# EAGLE design Maiskolben_THT (EAGLE 7.3.0)
CNAME: Maiskolben THT; CREVISION: 1.1; DESIGNER: Luca Zimmermann
Assembly variants: Mini USB, Mico USB

## Sheet 1 of 2
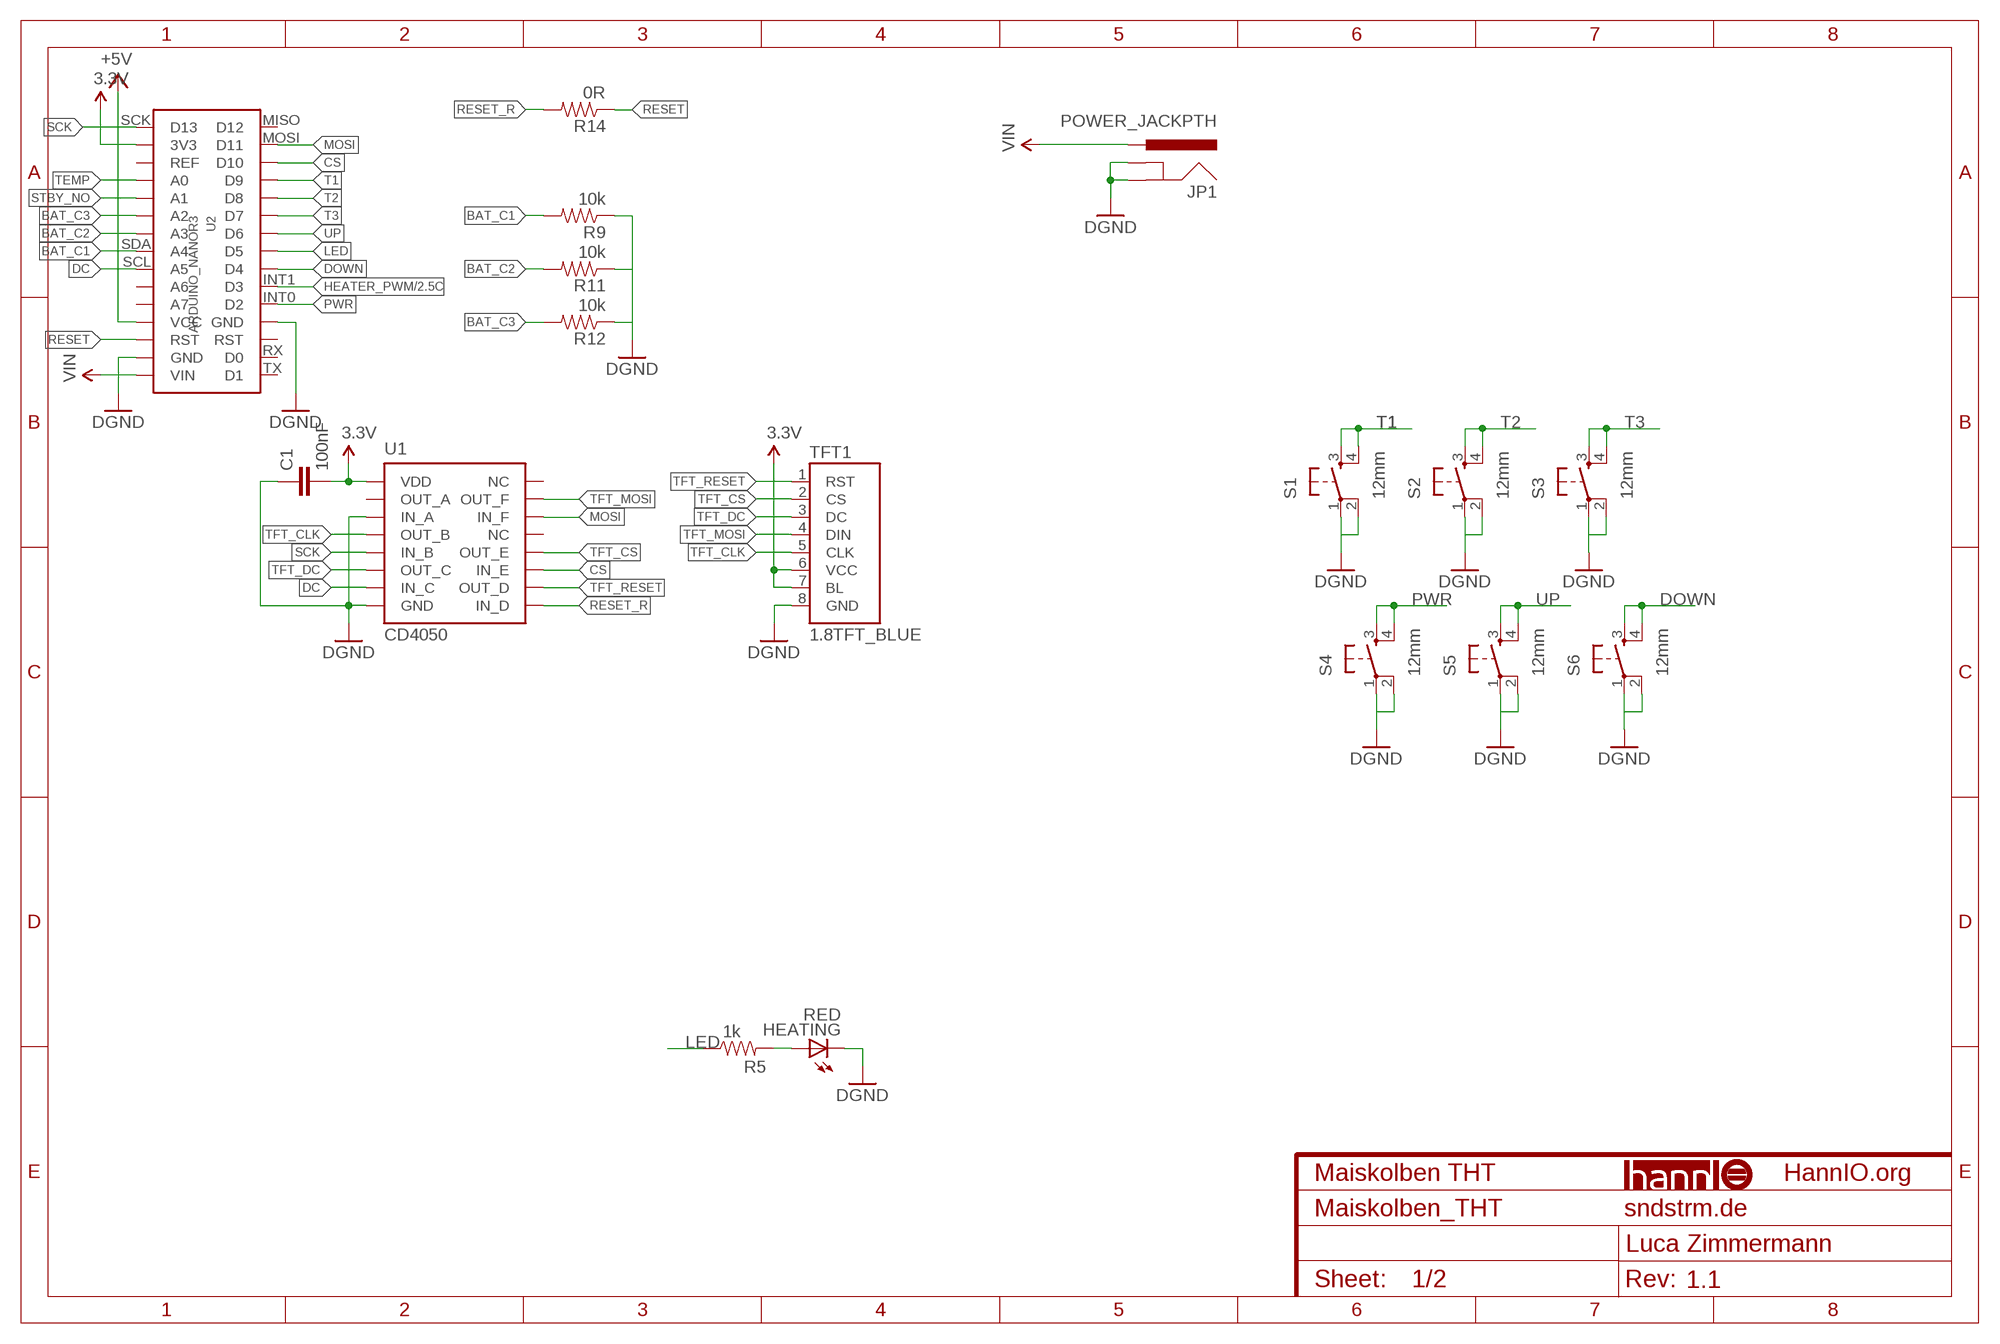
[diagram p0: schematic, sheet 1]

### Parts
C1  100nF  CAPEZ  [CAP-PTH-SMALLEZ]
HEATING  RED  LED5MM  [LED5MM]
JP1  POWER_JACKPTH  [POWER_JACK_PTH]
R5  1k  RESISTORAXIAL-0.3  [AXIAL-0.3]
R9  10k  RESISTORAXIAL-0.3  [AXIAL-0.3]
R11  10k  RESISTORAXIAL-0.3  [AXIAL-0.3]
R12  10k  RESISTORAXIAL-0.3  [AXIAL-0.3]
R14  0R  RESISTORAXIAL-0.3  [AXIAL-0.3]
S1  12mm  TAC_SWITCHPTH  [TACTILE-PTH]
S2  12mm  TAC_SWITCHPTH  [TACTILE-PTH]
S3  12mm  TAC_SWITCHPTH  [TACTILE-PTH]
S4  12mm  TAC_SWITCHPTH  [TACTILE-PTH]
S5  12mm  TAC_SWITCHPTH  [TACTILE-PTH]
S6  12mm  TAC_SWITCHPTH  [TACTILE-PTH]
TFT1  1.8TFT_BLUE  [1.8TFT_BLUE]
U1  CD4050DIP16  [CD4050]
U2  ARDUINO_NANOR3  [ARDUINO-NANO]
U$1  HANNIO_MEDIUM  [HANNIO_MEDIUM]

### Nets
3.3V: C1.2 TFT1.6(VCC) TFT1.7(BL) U1.VDD U2.3V3
+5V: U2.VCC ; also sheet 2
BAT_C1: R9.P$2 U2.SDA(A4)
BAT_C2: R11.P$2 U2.A3
BAT_C3: R12.P$2 U2.A2
CS: U1.IN_E U2.D10
DC: U1.IN_C U2.SCL(A5)
DGND: C1.1 HEATING.K(C) JP1.GND JP1.GNDBREAK R9.P$1 R11.P$1 R12.P$1 S1.1 S1.2 S2.1 S2.2 S3.1 S3.2 S4.1 S4.2 S5.1 S5.2 S6.1 S6.2 TFT1.8(GND) U1.GND U1.IN_A U2.GND@1(GND) U2.GND@2(GND) ; also sheet 2
DOWN: S6.3 S6.4 U2.D4
HEAT_LED: HEATING.A R5.P$2
HEATER_PWM: U2.INT1(D3) ; also sheet 2
LED: R5.P$1 U2.D5
MOSI: U1.IN_F U2.MOSI(D11)
PWR: S4.3 S4.4 U2.INT0(D2)
RESET: R14.P$1 U2.RST@2(RST)
RESET_R: R14.P$2 U1.IN_D
SCK: U1.IN_B U2.SCK(D13)
STBY_NO: U2.A1
T1: S1.3 S1.4 U2.D9
T2: S2.3 S2.4 U2.D8
T3: S3.3 S3.4 U2.D7
TEMP: U2.A0 ; also sheet 2
TFT_CLK: TFT1.5(CLK) U1.OUT_B
TFT_CS: TFT1.2(CS) U1.OUT_E
TFT_DC: TFT1.3(DC) U1.OUT_C
TFT_MOSI: TFT1.4(DIN) U1.OUT_F
TFT_RESET: TFT1.1(RST) U1.OUT_D
UP: S5.3 S5.4 U2.D6
VIN: JP1.PWR U2.VIN ; also sheet 2
Unconnected: U1.NC@1(NC) U1.NC@2(NC) U1.OUT_A U2.A6 U2.A7 U2.MISO(D12) U2.REF U2.RST@1(RST) U2.RX(D0) U2.TX(D1)

### Notes on the sheet
- HannIO.org
- sndstrm.de

## Sheet 2 of 2
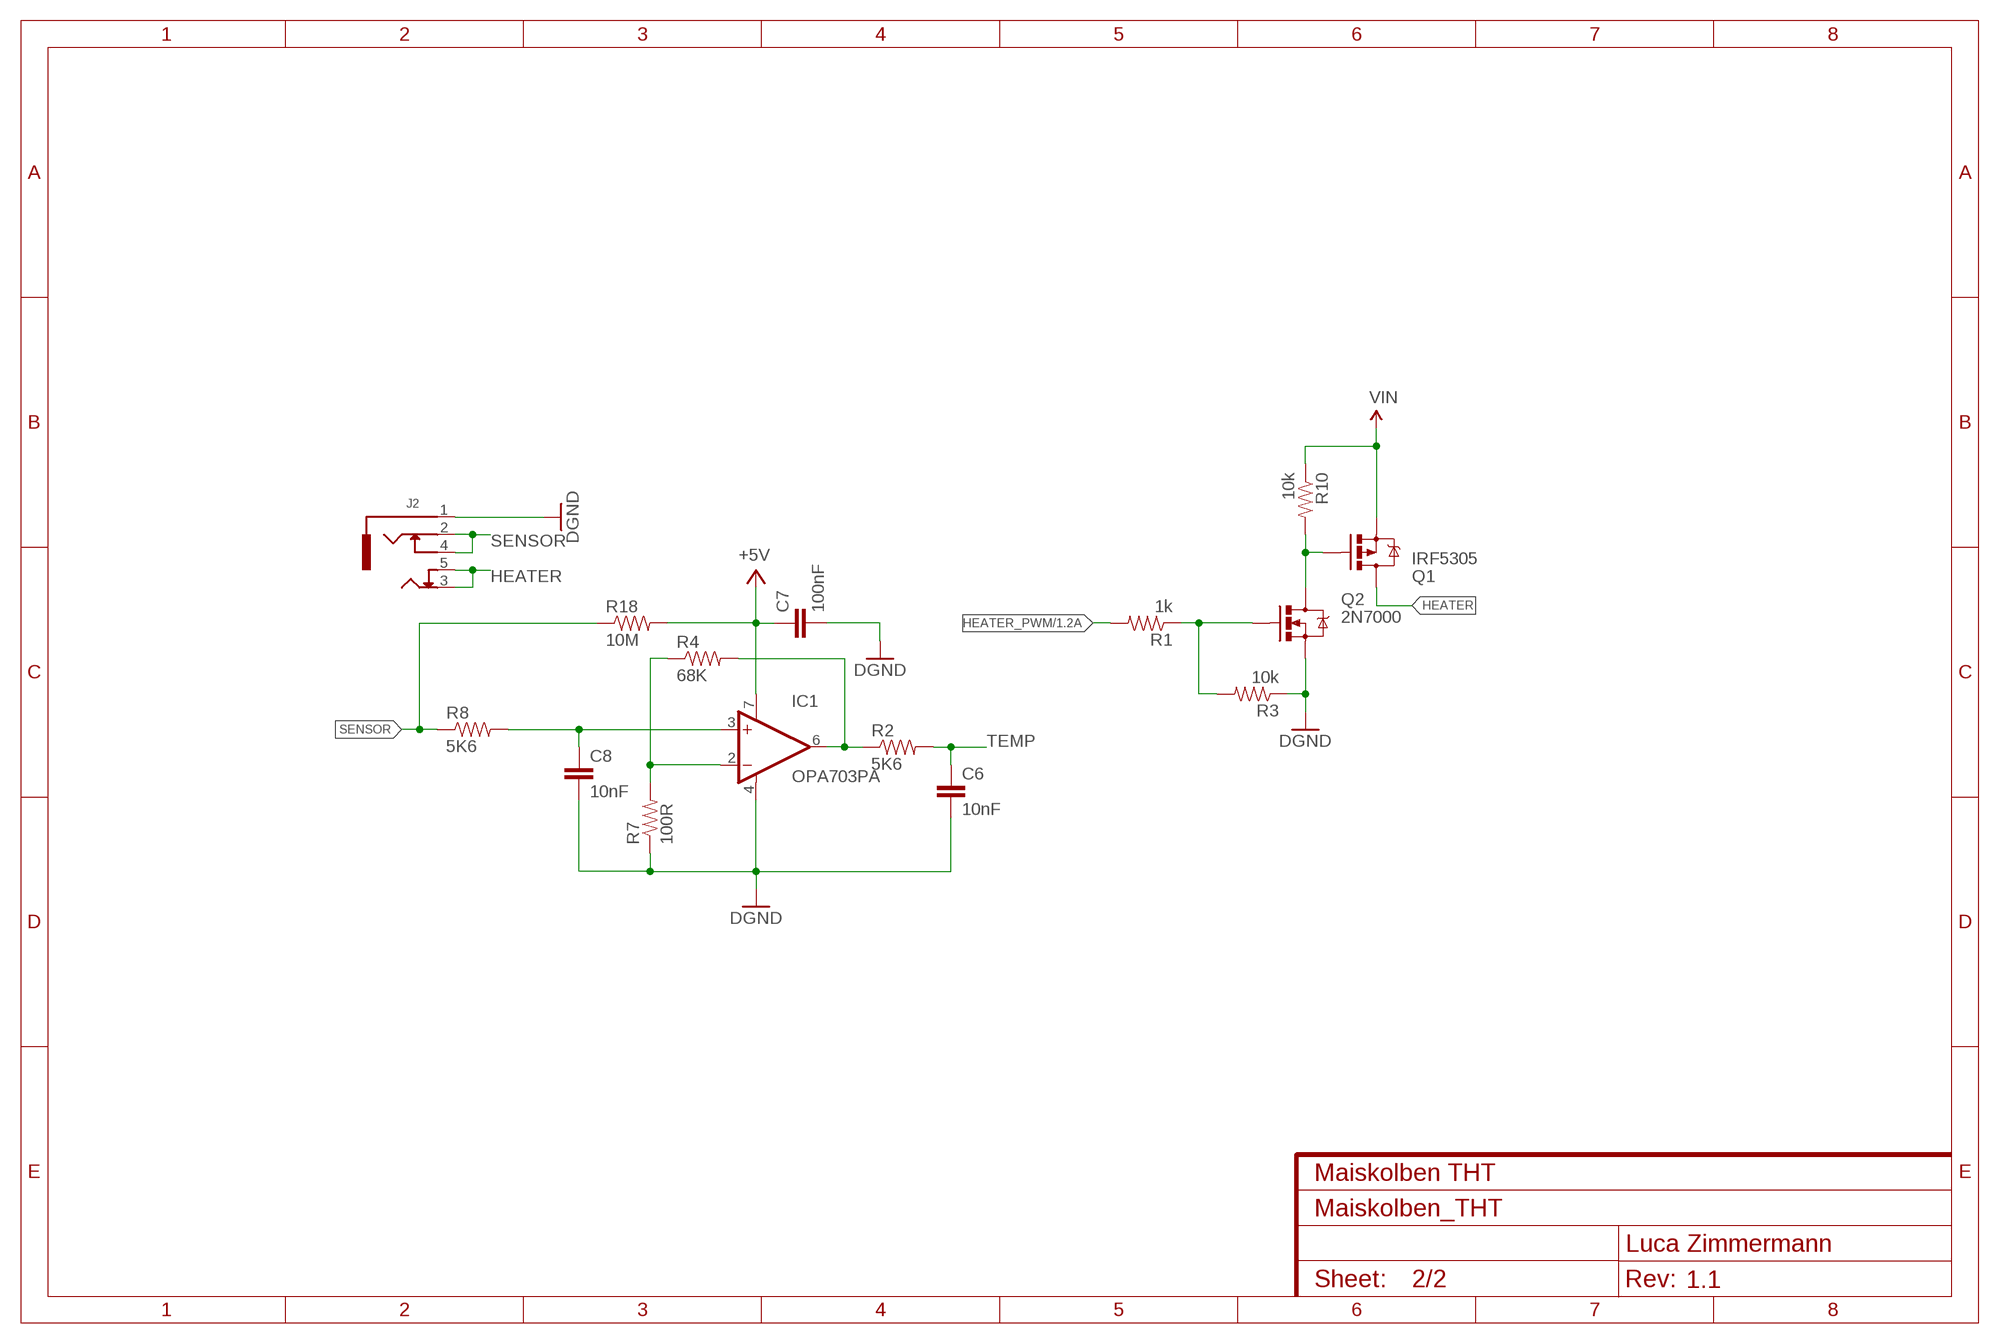
[diagram p1: schematic, sheet 2]

### Parts
C6  10nF  CAPEZ  [CAP-PTH-SMALLEZ]
C7  100nF  CAPEZ  [CAP-PTH-SMALLEZ]
C8  10nF  CAPEZ  [CAP-PTH-SMALLEZ]
IC1  OPA703PA  OPA340P  [DIL08]
J2  AUDIO_JACK_5PEBS_35  [EBS_35]
Q1  IRF5305  MOSFET-PCHANNELFQP27P06  [TO220V]
Q2  2N7000  MOSFET-NCHANNEL2N7000  [TO-92]
R1  1k  RESISTORAXIAL-0.3  [AXIAL-0.3]
R2  5K6  RESISTORAXIAL-0.3  [AXIAL-0.3]
R3  10k  RESISTORAXIAL-0.3  [AXIAL-0.3]
R4  68K  RESISTORAXIAL-0.3  [AXIAL-0.3]
R7  100R  RESISTORAXIAL-0.3  [AXIAL-0.3]
R8  5K6  RESISTORAXIAL-0.3  [AXIAL-0.3]
R10  10k  RESISTORAXIAL-0.3  [AXIAL-0.3]
R18  10M  RESISTORAXIAL-0.3  [AXIAL-0.3]

### Nets
+5V: C7.1 IC1.7(V+) R18.P$2 ; also sheet 1
DGND: C6.2 C7.2 C8.2 IC1.4(V-) J2.1(GND) Q2.1(S) R3.P$1 R7.P$1 ; also sheet 1
HEATER: J2.3(TIP) J2.5(TIP_NC) Q1.2(D)
HEATER_PWM: R1.P$2 ; also sheet 1
N$3: Q2.2(G) R1.P$1 R3.P$2
OPA+: C8.1 IC1.3(+IN) R8.P$2
OPA-: IC1.2(-IN) R4.P$1 R7.P$2
OPA_OUT: IC1.6(OUT) R2.P$1 R4.P$2
PMOS_IN: Q1.1(G) Q2.3(D) R10.P$2
SENSOR: J2.2(RING) J2.4(RING_NC) R8.P$1 R18.P$1
TEMP: C6.1 R2.P$2 ; also sheet 1
VIN: Q1.3(S) R10.P$1 ; also sheet 1

## Library data of the parts
C1 C6-C8 = SparkFun-Capacitors:CAP: Capacitor Standard 0603 ceramic capacitor, and 0.1" leaded capacitor.
HEATING = led:LED: LED OSRAM: - CHIPLED LG R971, LG N971, LY N971, LG Q971, LY Q971, LO R971, LY R971 LH N974, LH R974 LS Q976, LO Q976, LY Q976 LO Q996 - Hyper CHIPLED LW Q18S LB Q993, LB Q99A, LB R99A - SideLED LS A670, LO A670, LY A670, LG A670, LP A670 LB A673, LV A673, LT A673, LW A673 LH A674 LY A675 LS A676, LA A676, LO A676, LY A676, LW A676 LS A679, LY A679, LG A679 - Hyper Micro SIDELED® LS Y876, LA Y876, LO Y876, LY Y876 LT Y87S - SmartLED LW L88C, LW L88S LB L89C, LB L89S, LG L890 LS L89K, LO L89K, LY L89K LS L896, LA L896, LO L896, LY L896 - TOPLED LS T670, LO T670, LY T670, LG T670, LP T670 LSG T670, LSP T670, LSY T670, LOP T670, LYG T670 LG T671, LOG T671, LSG T671 LB T673, LV T673, LT T673, LW T673 LH T674 LS T676, LA T676, LO T676, LY T676, LB T676, LH T676, LSB T676, LW T676 LB T67C, LV T67C, LT T67C, LS T67K, LO T67K, LY T67K, LW E67C LS E67B, LA E67B, LO E67B, LY E67B, LB E67C, LV E67C, LT E67C LW T67C LS T679, LY T679, LG T679 LS T770, LO T770, LY T770, LG T770, LP T770 LB T773, LV T773, LT T773, LW T773 LH T774 LS E675, LA E675, LY E675, LS T675 LS T776, LA T776, LO T776, LY T776, LB T776 LHGB T686 LT T68C, LB T68C - Hyper Mini TOPLED® LB M676 - Mini TOPLED Santana® LG M470 LS M47K, LO M47K, LY M47K Source: http://www.osram.convergy.de LUXEON: - LUMILED® LXK2-PW12-R00, LXK2-PW12-S00, LXK2-PW14-U00, LXK2-PW14-V00 LXK2-PM12-R00, LXK2-PM12-S00, LXK2-PM14-U00 LXK2-PE12-Q00, LXK2-PE12-R00, LXK2-PE12-S00, LXK2-PE14-T00, LXK2-PE14-U00 LXK2-PB12-K00, LXK2-PB12-L00, LXK2-PB12-M00, LXK2-PB14-N00, LXK2-PB14-P00, LXK2-PB14-Q00 LXK2-PR12-L00, LXK2-PR12-M00, LXK2-PR14-Q00, LXK2-PR14-R00 LXK2-PD12-Q00, LXK2-PD12-R00, LXK2-PD12-S00 LXK2-PH12-R00, LXK2-PH12-S00 LXK2-PL12-P00, LXK2-PL12-Q00, LXK2-PL12-R00 Source: www.luxeon.com KINGBRIGHT: KA-3528ASYC Source: www.kingbright.com
IC1 = burr-brown:OPA340: Rail-to-Rail Operational Amplifiers Single-Supply, MicroAmplifier(TM) Series; MPN: OPA340PA; OC_FARNELL: 1097413; OC_NEWARK: 97K6826
J2 = rgb_matrix:AUDIO_JACK_5P
JP1 = SparkFun-Connectors:POWER_JACK: Power Jack This is the standard 5.5mm barrel jack for power. The PTH is the most common, proven, reliable, footprint. The Slot footprint only works if the mill layer is transmitted to the PCB fab house so be warned. Mating wall wart : TOL-00298 (and others); PROD_ID: CONN-08197
Q1 = SparkFun-DiscreteSemi:MOSFET-PCHANNEL: Generic PMOSFET IRLML2244 - TRANS-11153 (SOT-23 -20V -4.3A) (1.Gate 2.Source 3.Drain) FQP27P06 - COM-10349 <http://www.sparkfun.com/products/10349> (TO-220 -60V -27A) (1.Gate 2.Source 3.Drain)
Q2 = SparkFun-DiscreteSemi:MOSFET-NCHANNEL: Common NMOSFET Parts MFG P/N Store ID Prod ID FDD8780 TRANS-09984 SI7820DN TRANS-11055 FDS6630A IC-08089 2N7002PW TRANS-11151 FQP30N06L COM-10213 TRANS-10060 BSS123LT1G TRANS-08345 BSS138 TRANS-00830 BS170 2N7000
R1-R5 R7-R12 R14 R18 = SparkFun-Resistors:RESISTOR: Resistor Basic schematic elements and footprints for 0603, 1206, and PTH resistors.
S1-S6 = SparkFun-Retired:TAC_SWITCH: Momentary Switch Button commonly used for reset or general input. Spark Fun Electronics SKU : COM-00097 SMT- SWCH-08247
TFT1 = rgb_matrix:1.8TFT_BLUE
U1 = Aldar:CD4050
U2 = Aldar:ARDUINO_NANO: Arduino NANO R3
U$1 = rgb_matrix:HANNIO

## Board
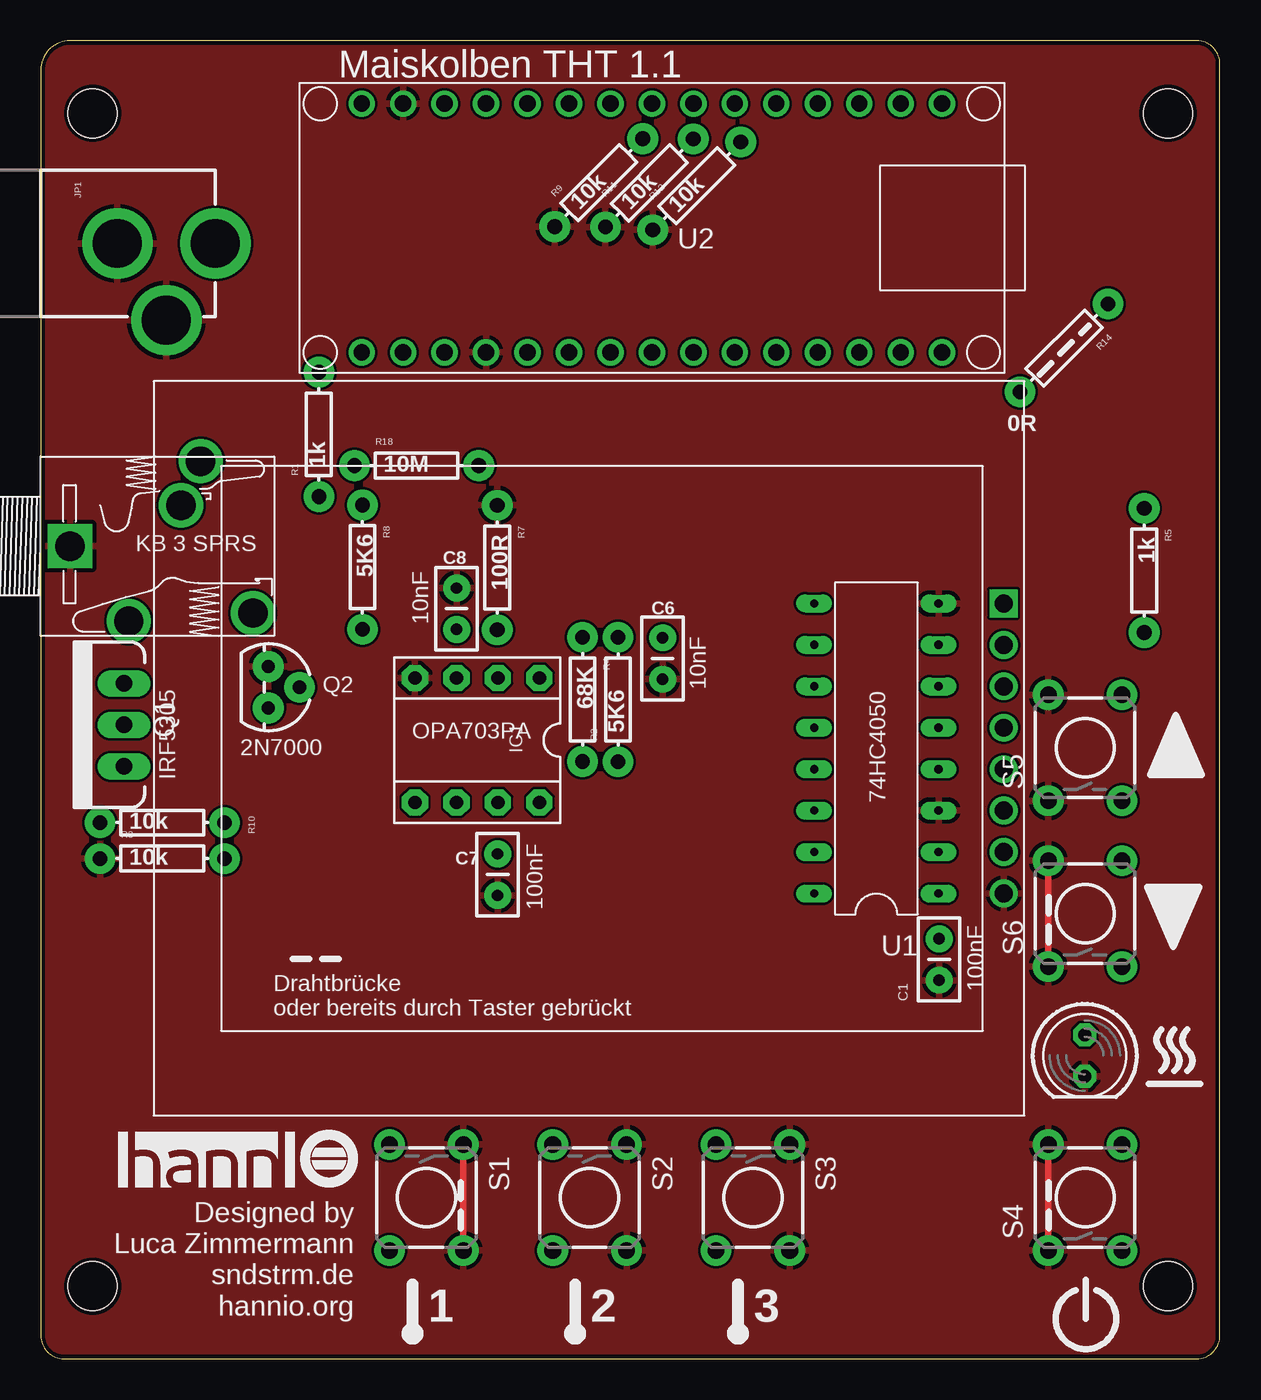
[diagram p2: board, top side]
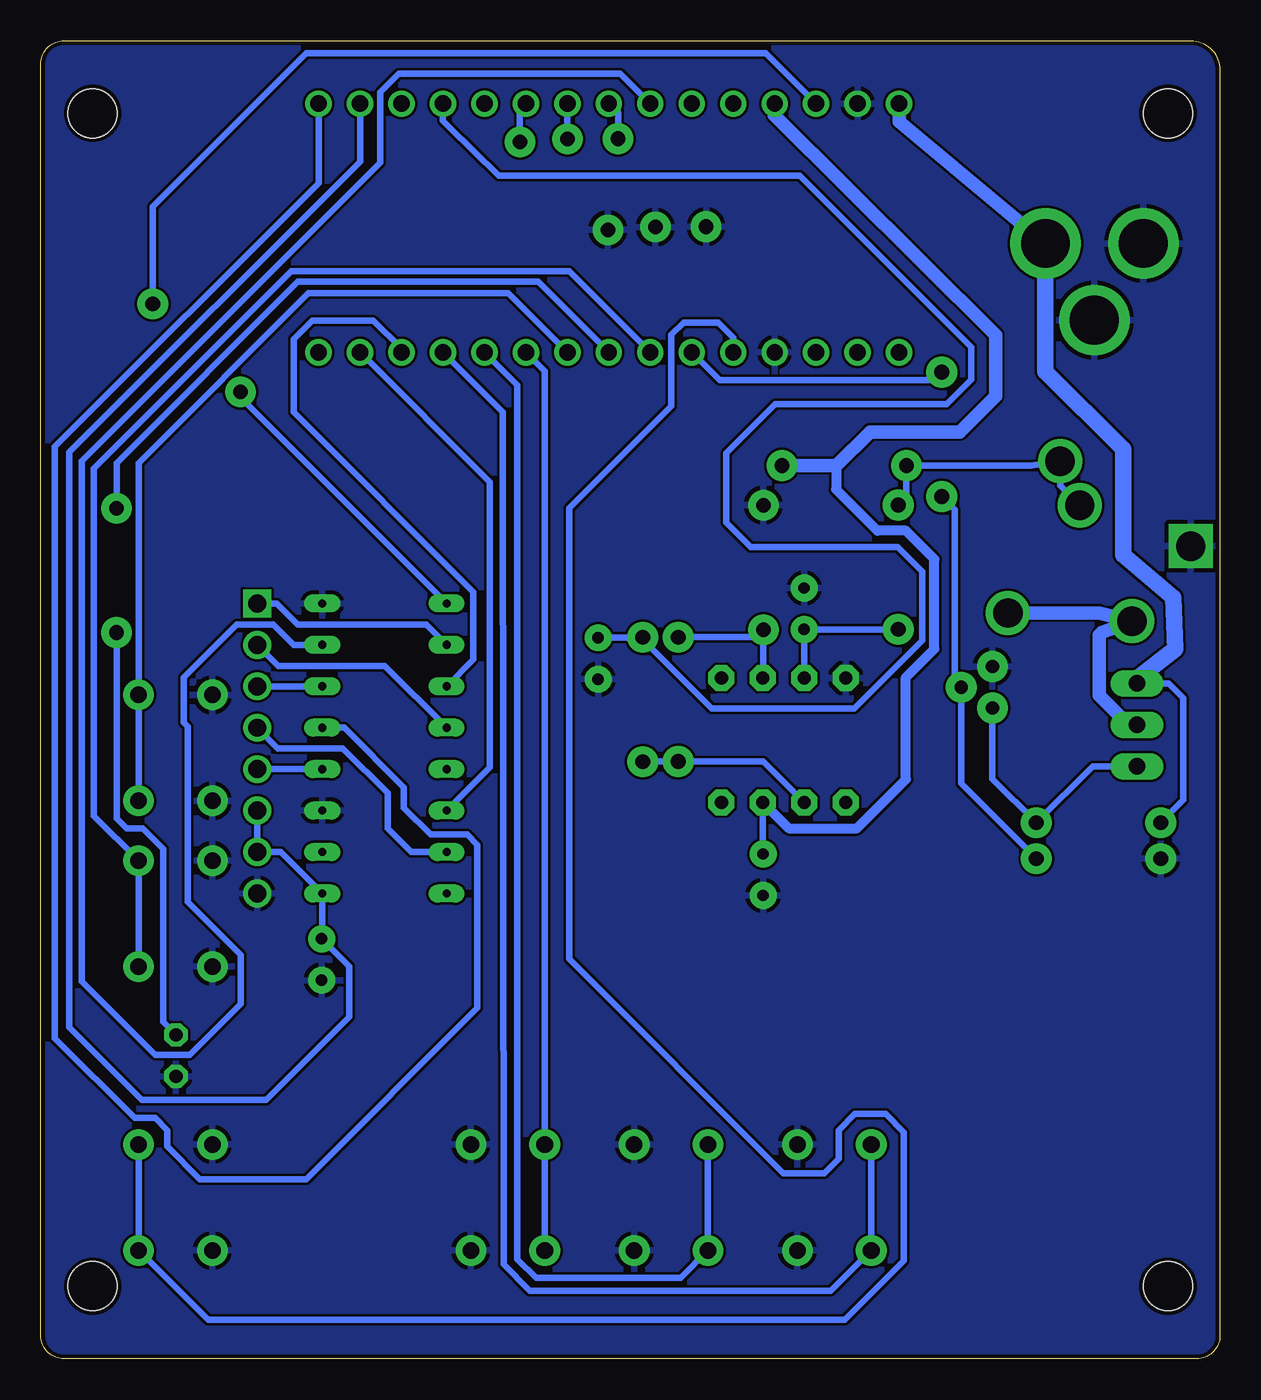
[diagram p3: board, bottom side, seen from below]

Size 72.24 x 80.77 mm. Coordinates in mm from the lower left corner, seen from the top.
Outline: 0,78.97 0,1.42 arc90 1.42,0 70.82,0 arc90 72.24,1.42 72.24,79.35 arc90 70.82,80.77 1.8,80.77 arc90 0,78.97
Copper layers (1*16): Top 0.035mm / dielectric 1.5mm / Bottom 0.035mm
Design rules "DFRobot_Eagle_Rule_v0.4": minimum track width 6mil, minimum drill 12mil, track to track 6mil, track to pad 6mil, pad to pad 6mil, via to via 6mil, smd to smd 0mil, copper to edge 10mil, drill to drill 10mil, minimum pad ring 12mil, minimum via ring 8mil, stop-mask expansion 2mil, vias tented up to drill 25mil, thermal gap 10mil
Holes 3 mm at 3.17,76.33 3.17,4.45 69.06,76.33 69.06,4.45

### Footprints (pad centres in the part's own frame; a part is rotated, then mirrored left to right if it is on the bottom)
CAP-PTH-SMALLEZ = drill 0.7 pad 1.651: 1 0,0; 2 2.54,0
LED5MM = drill 0.813 octagon: A -1.27,0; K 1.27,0
DIL08 = drill 0.813 pad 1.6 octagon: 1 -3.81,-3.81; 2 -1.27,-3.81; 3 1.27,-3.81; 4 3.81,-3.81; 5 3.81,3.81; 6 1.27,3.81; 7 -1.27,3.81; 8 -3.81,3.81
EBS_35 = drill 1.8 square: 1 5.4,0 | drill 1.8: 2 13.4,5.2; 3 9,-4.6; 4 12.2,2.5; 5 16.6,-4.1
POWER_JACK_PTH = drill 2.997 pad 4.318: GND 0,7.7; GNDBREAK 4.7,10.7; PWR 0,13.7
TO220V = drill 1.016 long: 1 -2.54,0; 2 0,0; 3 2.54,0
TO-92 = drill 0.813 pad 1.88: 1 -1.27,0; 2 0,1.905; 3 1.27,0
AXIAL-0.3 = drill 0.9 pad 1.88: P$1 -3.81,0; P$2 3.81,0
TACTILE-PTH = drill 1.016 pad 1.88: 1 -3.251,2.261; 2 3.251,2.261; 3 -3.251,-2.261; 4 3.251,-2.261
1.8TFT_BLUE = drill 1.1 square: 1 25.4,8.89 | drill 1.1: 2 25.4,6.35; 3 25.4,3.81; 4 25.4,1.27; 5 25.4,-1.27; 6 25.4,-3.81; 7 25.4,-6.35; 8 25.4,-8.89
CD4050 = drill 0.5 long: GND -3.81,-8.89; IN_A -3.81,3.81; IN_B -3.81,-1.27; IN_C -3.81,-6.35; IN_D 3.81,-8.89; IN_E 3.81,-3.81; IN_F 3.81,3.81; NC@1 3.81,8.89; NC@2 3.81,1.27; OUT_A -3.81,6.35; OUT_B -3.81,1.27; OUT_C -3.81,-3.81; OUT_D 3.81,-6.35; OUT_E 3.81,-1.27; OUT_F 3.81,6.35; VDD -3.81,8.89
ARDUINO-NANO = drill 1: 3V3 -15.24,-7.62; A0 -10.16,-7.62; A1 -7.62,-7.62; A2 -5.08,-7.62; A3 -2.54,-7.62; A6 5.08,-7.62; A7 7.62,-7.62; D4 2.54,7.62; D5 0,7.62; D6 -2.54,7.62; D7 -5.08,7.62; D8 -7.62,7.62; D9 -10.16,7.62; D10 -12.7,7.62; GND@1 10.16,7.62; GND@2 15.24,-7.62; INT0 7.62,7.62; INT1 5.08,7.62; MISO -17.78,7.62; MOSI -15.24,7.62; REF -12.7,-7.62; RST@1 12.7,7.62; RST@2 12.7,-7.62; RX 15.24,7.62; SCK -17.78,-7.62; SCL 2.54,-7.62; SDA 0,-7.62; TX 17.78,7.62; VCC 10.16,-7.62; VIN 17.78,-7.62

### Placement (x,y rotation side)
C1  55.04,23.2 90 top
C6  38.09,44.18 270 top
C7  27.99,30.93 270 top
C8  25.47,44.69 90 top
HEATING  63.96,18.58 270 top
IC1  26.73,37.91 180 top
J2  -3.61,49.8 0 top
JP1  -3.01,68.35 270 top
Q1  5.09,38.85 90 top
Q2  13.94,41.15 270 top
R1  17.04,56.65 90 top
R2  35.36,40.4 90 top
R3  7.44,30.65 0 top
R4  33.19,40.41 270 top
R5  67.6,48.31 270 top
R7  27.96,48.49 270 top
R8  19.71,48.51 270 top
R9  34.18,72.07 45 top
R10  7.44,32.85 0 top
R11  37.28,72.06 45 top
R12  40.19,71.88 45 top
R14  62.69,61.94 225 top
R18  23.02,54.73 0 top
S1  23.62,9.88 270 top
S2  33.62,9.88 270 top
S3  43.62,9.88 270 top
S4  63.98,9.88 90 top
S5  63.98,37.44 90 top
S6  63.98,27.28 90 top
TFT1  33.59,37.4 0 top
U1  51.19,37.4 180 top
U2  37.44,69.3 180 top
U$1  4.74,10.5 0 top

### Tracks (layer width: path | path; a pad name or v marks a point on that pad's centre or on a via)
3.3V
  Bottom 0.406: TFT1.6 TFT1.7 57.54,31.05 U1.VDD 55,25.78 C1.2 53.34,24.04 53.34,20.95 58.42,15.88 66.04,15.88 70.48,20.32 70.48,55.56 52.68,73.37 U2.3V3
+5V
  Bottom 0.406: IC1.7 28,30.95 C7.1
  Bottom 0.61: IC1.7 26.41,32.5 22.24,32.5 19.24,35.5 19.24,41.75 17.49,43.5 17.49,49 19.24,50.75 20.99,50.75 23.51,53.27 23.51,54.73
  Bottom 0.813: R18.P$2 23.51,54.73 21.44,56.8 15.94,56.8 13.74,59 13.74,62.74 27.3,76.2 27.3,76.92 U2.VCC
BAT_C1
  Bottom 0.406: R9.P$2 36.87,76.36 U2.SDA
BAT_C2
  Bottom 0.406: R11.P$2 U2.A3
BAT_C3
  Bottom 0.406: R12.P$2 42.88,76.56 U2.A2
CS
  Bottom 0.406: U1.IN_E 45.74,42.85 45.74,47 56.74,58 56.74,62.5 55.61,63.62 51.86,63.62 50.14,61.9 U2.D10
DC
  Bottom 0.406: U2.SCL 36.73,78.75 50.32,78.75 51.45,77.62 51.45,73.29 69.74,55 69.74,23.12 65.24,18.62 63.11,18.62 59.99,21.75 59.99,24.75 63.24,28 63.24,38.75 63.49,39 63.49,41.75 60.24,45 57.99,45 56.74,43.75 U1.IN_C
DGND
  Top 0.406: S6.1 S6.2 | S1.2 S1.1 | S4.1 S4.2
  pour Bottom: 72.24,0 0,0 0,80.77 72.24,80.77
  pour Top: 80.64,-0.8 80.64,81.28 -0.12,81.28 -0.12,-0.8
DOWN
  Bottom 0.406: S6.3 S6.4 68.99,33.27 68.99,54.55 56.89,66.65 39.87,66.65 U2.D4
HEAT_LED
  Bottom 0.406: R5.P$2 67.6,33.11 66.99,32.5 65.99,32.5 64.74,31.25 64.74,20.63 HEATING.A
HEATER
  Bottom 0.813: Q1.2 5.74,39 7.39,40.65 7.39,44.35 7.24,44.5 J2.3 7.39,45.7 J2.5
HEATER_PWM
  Bottom 0.406: R1.P$2 17.24,60.5 17.78,59.96 30.64,59.96 U2.INT1
LED
  Bottom 0.406: U2.D5 41.76,66 56.49,66 67.6,54.89 R5.P$1
MOSI
  Bottom 0.406: U2.MOSI 44.74,53.74 44.74,36.23 U1.IN_F
N$3
  Bottom 0.406: R3.P$2 15.84,35.24 Q2.2 16.24,41.55 16.24,52.04 R1.P$1
OPA+
  Bottom 0.406: R8.P$2 C8.1 | C8.1 | C8.1 IC1.3
OPA-
  Bottom 0.406: IC1.2 27.96,41.76 R7.P$2 28.43,44.22 R4.P$1
OPA_OUT
  Bottom 0.406: R2.P$1 33.2,36.59 R4.P$2 27.97,36.6 IC1.6
PMOS_IN
  Bottom 0.406: Q1.1 7.79,36.31 R10.P$2 13.94,35.54 Q2.3
PWR
  Bottom 0.406: S4.4 S4.3 61.99,2.38 22.99,2.38 19.36,6 19.36,13.88 20.49,15 22.37,15 23.36,14.01 23.36,12.25 24.24,11.38 26.74,11.38 39.86,24.5 39.86,52.12 33.61,58.38 33.61,62.75 32.86,63.5 30.74,63.5 29.82,62.58 U2.INT0
RESET
  Bottom 0.406: U2.RST@2 27.82,80 55.99,80 65.39,70.6 R14.P$1
RESET_R
  Bottom 0.406: U1.IN_D 59.94,58.85 R14.P$2
SCK
  Bottom 0.406: U1.IN_B 53.66,38.67 49.99,35 49.99,33.75 48.36,32.12 46.11,32.12 45.49,31.5 45.49,21.5 55.99,11 62.49,11 64.49,13 64.49,14 65.24,14.75 66.49,14.75 71.37,19.64 71.37,55.88 55.22,72.04 U2.SCK
SENSOR
  Bottom 0.406: R8.P$1 19.21,52.82 R18.P$1 11.56,54.73 J2.2 9.79,53.5 J2.4
T1
  Bottom 0.406: U2.D9 43.94,58.02 43.89,5.8 42.29,4.15 23.84,4.15 S1.4 S1.3
T2
  Bottom 0.406: U2.D8 43.04,59.66 43.04,6.1 41.89,4.95 33.04,4.95 S2.4 S2.3
T3
  Bottom 0.406: U2.D7 41.36,60.52 S3.3 S3.4
TEMP
  Bottom 0.406: R2.P$2 35.5,44.21 | C6.1 38.07,44.21 35.5,44.21 | 35.5,44.21 31.14,39.85 22.39,39.85 18.24,44 18.24,48.25 19.74,49.75 28.74,49.75 30.24,51.25 30.24,55.5 27.24,58.5 16.74,58.5 15.24,60 15.24,62 25.74,72.5 44.18,72.5 47.24,75.5 47.6,75.86 U2.A0
TFT_CLK
  Bottom 0.406: U1.OUT_B TFT1.5
TFT_CS
  Bottom 0.406: TFT1.2 57.69,42.45 51.16,42.45 U1.OUT_E
TFT_DC
  Bottom 0.406: U1.OUT_C TFT1.3
TFT_MOSI
  Bottom 0.406: TFT1.4 57.72,37.4 53.73,37.4 50.99,34.66 50.99,32.5 49.54,31.05 U1.OUT_F
TFT_RESET
  Bottom 0.406: U1.OUT_D 48.63,45 56.49,45 57.78,46.29 TFT1.1
UP
  Bottom 0.406: U2.D6 43.6,65.3 55.84,65.3 66.25,54.89 S5.4 S5.3
VIN
  Bottom 0.406: R10.P$1 2.24,34.24 2.24,40.5 3.13,41.39 Q1.3
  Bottom 0.813: JP1.PWR 19.66,75.82 U2.VIN
  Bottom 1.016: Q1.3 5.09,41.65 2.74,43.5 2.85,46.66 5.94,49.25 5.94,55.75 10.69,60.5 JP1.PWR

### Text on the board
tPlace: Maiskolben THT 1.1 | KB 3 SPRS | 10nF | 10nF | 2N7000 | OPA703PA | 74HC4050 | IRF5305 | 100nF | 100nF | Drahtbrücke / oder bereits durch Taster gebrückt | Designed by / Luca Zimmermann / sndstrm.de / hannio.org | 1 | 2 | 3
_bPlace: U3
_bNames: R10 | ISP | R11 | R12 | AUTORESET | R1 | R16 | R19 | C1 | C11 | J2 | D1 | D2 | C12 | S7 | C3 | F1 | Y1 | U1 | C2 | C4 | R15 | R17 | C5 | R14 | R9 | Y2 | Q1 | U2 | Q2 | IC2 | U4 | J1 | C6 | C10 | C8 | R6 | R4 | C9 | R2 | R5 | R8 | C7 | IC1 | R18 | R3 | R7
_bValues: ISP